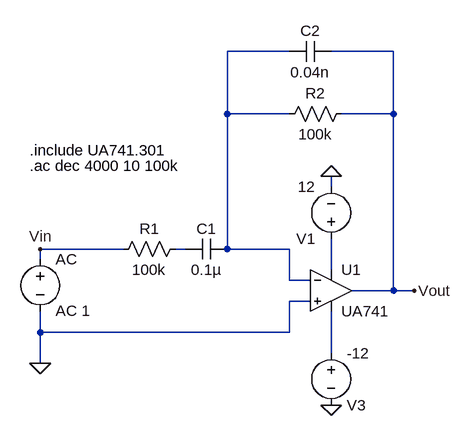
[diagram p0: schematic active_band_pass_filter.asc]
active_band_pass_filter.asc, the LTspice schematic file:
Version 4
SHEET 1 880 680
WIRE 432 -176 336 -176
WIRE 592 -176 496 -176
WIRE 336 -80 336 -176
WIRE 432 -80 336 -80
WIRE 592 -80 592 -176
WIRE 592 -80 512 -80
WIRE 496 32 496 16
WIRE 176 128 48 128
WIRE 272 128 256 128
WIRE 336 128 336 -80
WIRE 432 128 336 128
WIRE 48 144 48 128
WIRE 496 160 496 112
WIRE 432 176 432 128
WIRE 464 176 432 176
WIRE 592 192 592 -80
WIRE 592 192 528 192
WIRE 624 192 592 192
WIRE 464 208 432 208
WIRE 48 256 48 224
WIRE 432 256 432 208
WIRE 432 256 48 256
WIRE 496 288 496 224
WIRE 48 304 48 256
FLAG 48 304 0
FLAG 496 16 0
FLAG 496 368 0
FLAG 624 192 Vout
FLAG 48 128 Vin
SYMBOL voltage 496 128 R180
WINDOW 123 0 0 Left 0
WINDOW 39 0 0 Left 0
SYMATTR InstName V1
SYMATTR Value 12
SYMBOL voltage 48 128 R0
WINDOW 123 24 95 Left 2
WINDOW 39 0 0 Left 0
SYMATTR Value2 AC 1
SYMATTR InstName AC
SYMATTR Value ""
SYMBOL res 272 112 R90
WINDOW 0 0 56 VBottom 2
WINDOW 3 32 56 VTop 2
SYMATTR InstName R1
SYMATTR Value 100k
SYMBOL cap 336 112 R90
WINDOW 0 0 32 VBottom 2
WINDOW 3 32 32 VTop 2
SYMATTR InstName C1
SYMATTR Value 0.1µ
SYMBOL res 528 -96 R90
WINDOW 0 0 56 VBottom 2
WINDOW 3 32 56 VTop 2
SYMATTR InstName R2
SYMATTR Value 100k
SYMBOL cap 496 -192 R90
WINDOW 0 0 32 VBottom 2
WINDOW 3 32 32 VTop 2
SYMATTR InstName C2
SYMATTR Value 0.04n
SYMBOL OpAmps\\opamp2 496 128 R0
SYMATTR InstName U1
SYMATTR Value UA741
SYMBOL voltage 496 272 R0
WINDOW 0 24 96 Left 2
WINDOW 3 24 16 Left 2
WINDOW 123 0 0 Left 0
WINDOW 39 0 0 Left 0
SYMATTR InstName V3
SYMATTR Value -12
TEXT 32 -24 Left 2 !.include UA741.301
TEXT 32 0 Left 2 !.ac dec 4000 10 100k

The netlist it stands for:
* active_band_pass_filter.asc
V1 N003 0 12
V§AC Vin 0 AC 1
R1 N002 Vin 100k
C1 N001 N002 0.1µ
R2 Vout N001 100k
C2 Vout N001 0.04n
XU1 0 N001 N003 N004 Vout UA741  ; pins In+ In- V+ V- OUT
V3 N004 0 -12
.include UA741.301
.ac dec 4000 10 100k
.backanno
.end